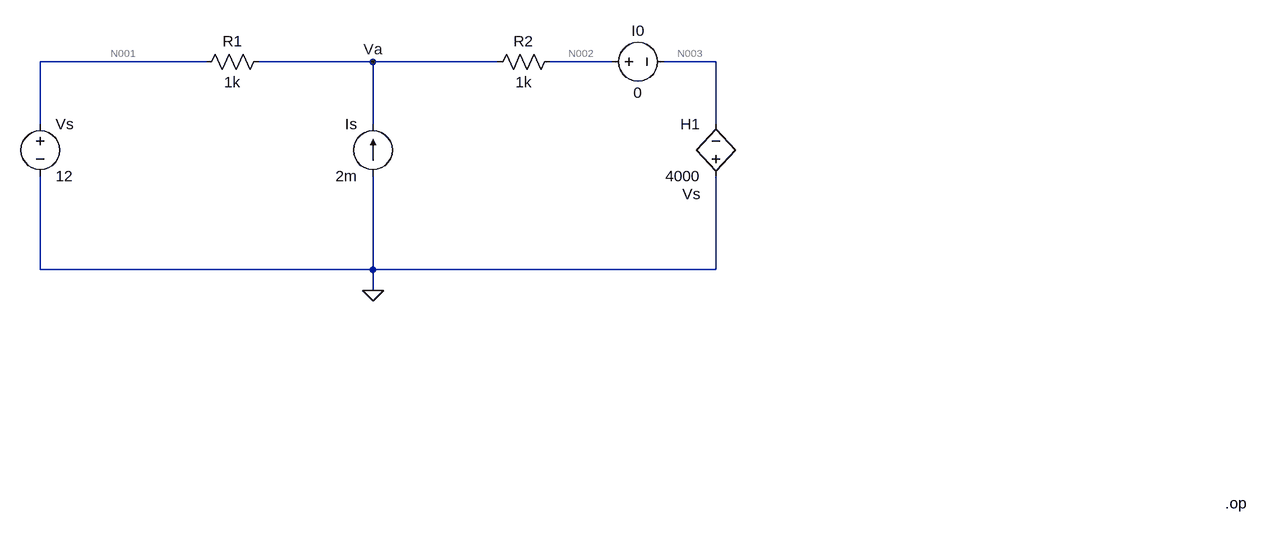
[diagram p0: schematic HW02-03.asc]
HW02-03.asc, the LTspice schematic file:
Version 4
SHEET 1 1848 696
WIRE 240 0 -16 0
WIRE 496 0 320 0
WIRE 688 0 496 0
WIRE 864 0 768 0
WIRE 1024 0 944 0
WIRE -16 96 -16 0
WIRE 496 96 496 0
WIRE 1024 96 1024 0
WIRE -16 320 -16 176
WIRE 496 320 496 176
WIRE 496 320 -16 320
WIRE 1024 320 1024 176
WIRE 1024 320 496 320
WIRE 496 352 496 320
FLAG 496 352 0
FLAG 496 0 Va
SYMBOL voltage -16 80 R0
SYMATTR InstName Vs
SYMATTR Value 12
SYMBOL res 336 -16 R90
WINDOW 0 0 56 VBottom 2
WINDOW 3 32 56 VTop 2
SYMATTR InstName R1
SYMATTR Value 1k
SYMBOL res 784 -16 R90
WINDOW 0 0 56 VBottom 2
WINDOW 3 32 56 VTop 2
SYMATTR InstName R2
SYMATTR Value 1k
SYMBOL h 1024 192 R180
WINDOW 0 24 96 Left 2
WINDOW 3 24 16 Left 2
WINDOW 38 24 -12 Left 2
SYMATTR InstName H1
SYMATTR Value 4000
SYMATTR SpiceModel Vs
SYMBOL current 496 176 R180
WINDOW 0 24 80 Left 2
WINDOW 3 24 0 Left 2
SYMATTR InstName Is
SYMATTR Value 2m
SYMBOL voltage 848 0 R270
WINDOW 0 32 56 VTop 2
WINDOW 3 -32 56 VBottom 2
SYMATTR InstName I0
SYMATTR Value 0
TEXT 1808 680 Left 2 !.op

The netlist it stands for:
* HW02-03.asc
Vs N001 0 12
R1 Va N001 1k
R2 N002 Va 1k
H1 0 N003 Vs 4000
Is 0 Va 2m
V§I0 N002 N003 0
.op
.backanno
.end

* Results of the author's LTspice run, read from the files saved beside the schematic
* Operating Point:
*   V(n001) = 12 V
*   V(va) = 10.33 V
*   V(n002) = 6.667 V
*   V(n003) = 6.667 V
*   I(H1) = -3.667 mA
*   I(Is) = 2 mA
*   I(R1) = -1.667 mA
*   I(R2) = -3.667 mA
*   I(Vs) = -1.667 mA
*   I(I0) = 3.667 mA